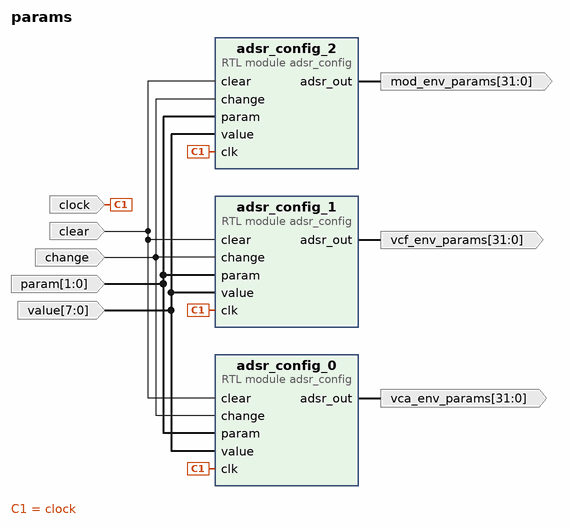
[diagram p0: block diagram of the top level]
# Vivado block design params, xc7z020clg400-1, Vivado 2018.3
create_bd_design params

create_bd_port -dir O -from 31 -to 0 -type data vca_env_params
create_bd_port -dir O -from 31 -to 0 -type data vcf_env_params
create_bd_port -dir O -from 31 -to 0 -type data mod_env_params
create_bd_port -dir I -type data clock
create_bd_port -dir I -type rst clear
set_property -dict {CONFIG.POLARITY ACTIVE_HIGH} [get_bd_ports clear]
create_bd_port -dir I -type data change
create_bd_port -dir I -from 1 -to 0 -type data param
create_bd_port -dir I -from 7 -to 0 -type data value

create_bd_cell -type module -reference adsr_config adsr_config_0
create_bd_cell -type module -reference adsr_config adsr_config_1
create_bd_cell -type module -reference adsr_config adsr_config_2

# ---- connections ----

connect_bd_net [get_bd_pins adsr_config_0/adsr_out] [get_bd_ports vca_env_params]
connect_bd_net [get_bd_pins adsr_config_1/adsr_out] [get_bd_ports vcf_env_params]
connect_bd_net [get_bd_pins adsr_config_2/adsr_out] [get_bd_ports mod_env_params]
connect_bd_net [get_bd_ports clock] [get_bd_pins adsr_config_0/clk] [get_bd_pins adsr_config_1/clk] [get_bd_pins adsr_config_2/clk]
connect_bd_net -net init_1 [get_bd_ports clear] [get_bd_pins adsr_config_0/clear] [get_bd_pins adsr_config_1/clear] [get_bd_pins adsr_config_2/clear]
connect_bd_net [get_bd_ports change] [get_bd_pins adsr_config_0/change] [get_bd_pins adsr_config_1/change] [get_bd_pins adsr_config_2/change]
connect_bd_net [get_bd_ports param] [get_bd_pins adsr_config_0/param] [get_bd_pins adsr_config_1/param] [get_bd_pins adsr_config_2/param]
connect_bd_net [get_bd_ports value] [get_bd_pins adsr_config_1/value] [get_bd_pins adsr_config_0/value] [get_bd_pins adsr_config_2/value]

validate_bd_design
save_bd_design
